# Altium project PA_v2.PrjPcb
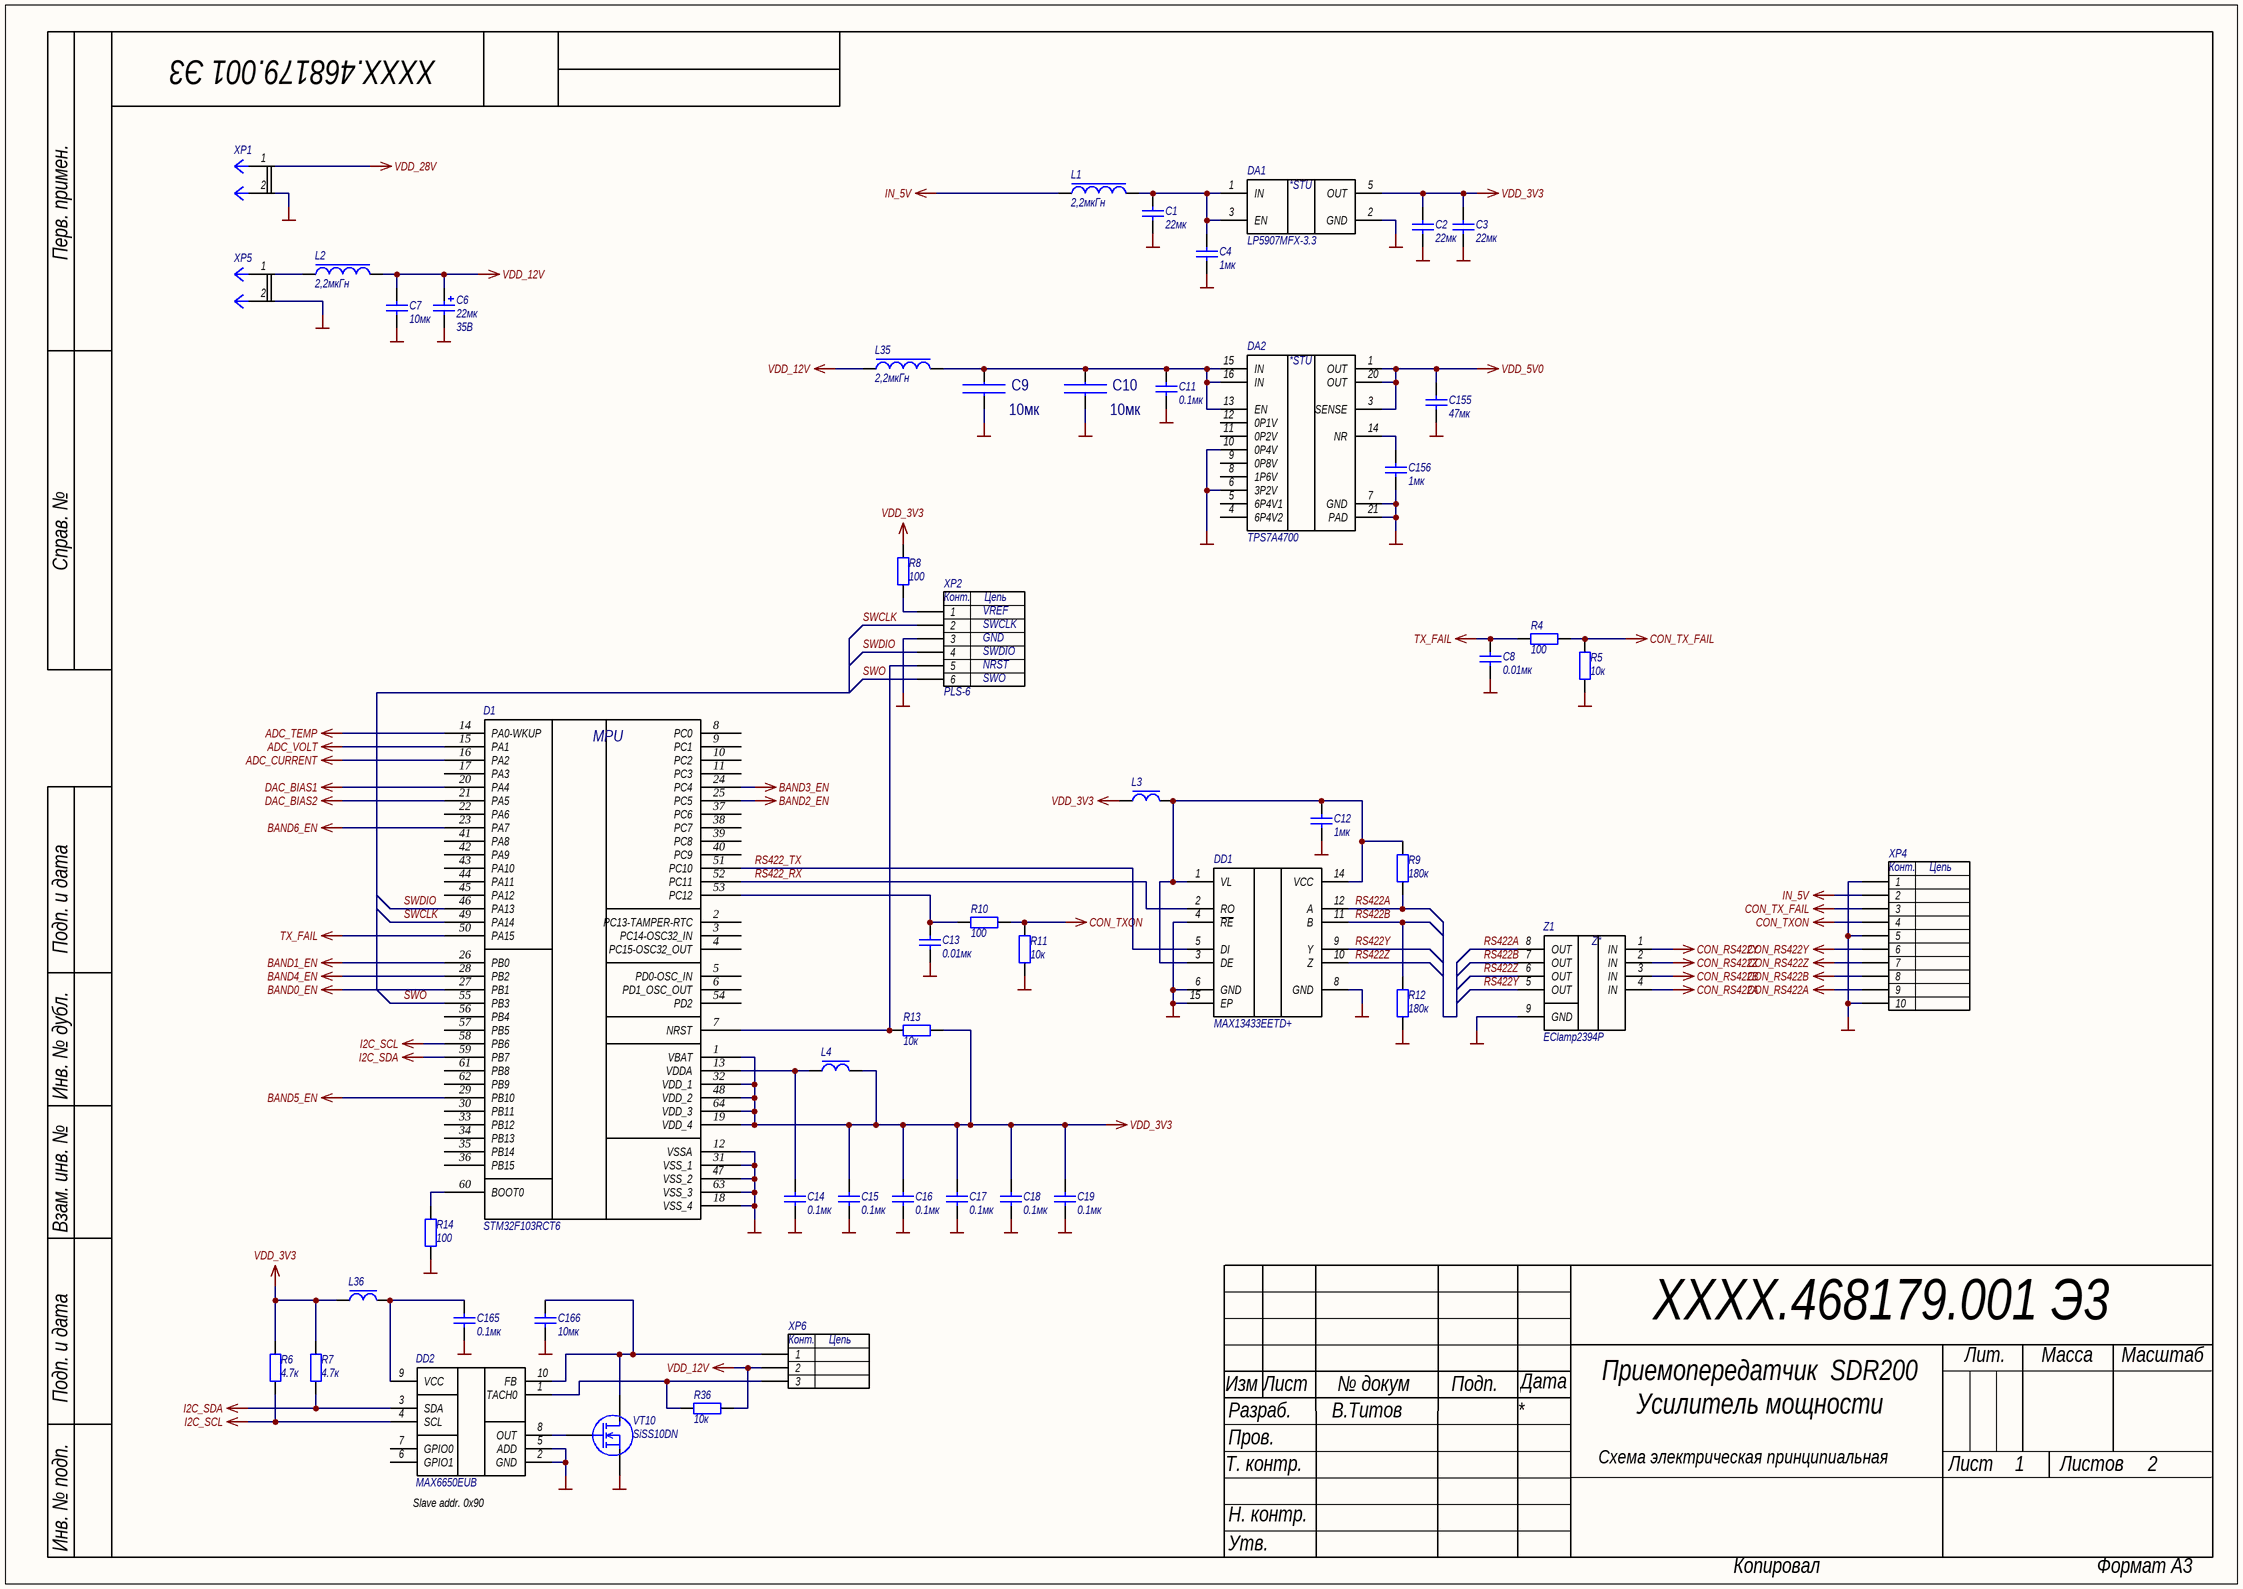
[diagram p0: PA_MCU.SchDoc]
2 sheets, 152 parts. Net scope: global (net labels, ports and power ports of the same name join across sheets).
Board file: PA_v2.PcbDoc
Sheets:
  PA_MCU.SchDoc
  PA_AMP.SchDoc

## Sheet PA_MCU.SchDoc: Приемопередатчик  SDR200
size 420 x 297 mm; Author: В.Титов; DrawnBy: В.Титов; DocumentNumber: ХХХХ.468179.001 Э3; SheetNumber: 1; SheetTotal: 2; DocumentType: Схема электрическая принципиальная; Title2: Усилитель мощности; Scale: 1:1

### Parts
C1  22мк  [CAPC2012X12L]
C2  22мк  [CAPC2012X12L]
C3  22мк  [CAPC2012X12L]
C4  1мк  [CAPC1005X06N]
C6  Power/Voltage: 35В  [CAPMP7343X28L]  (hidden comment: 22мк)
C7  10мк  [CAPC3225X27L]
C8  0.01мк  [CAPC1005X06N]
C9  Nominal: 10мк  [CAPC2012X09L]  (hidden comment: CC0805KKX5R8BB106)
C10  Nominal: 10мк  [CAPC2012X09L]  (hidden comment: CC0805KKX5R8BB106)
C11  0.1мк  [CAPC1005X06N]
C12  1мк  [CAPC1005X06N]
C13  0.01мк  [CAPC1005X06N]
C14  0.1мк  [CAPC1005X06N]
C15  0.1мк  [CAPC1005X06N]
C16  0.1мк  [CAPC1005X06N]
C17  0.1мк  [CAPC1005X06N]
C18  0.1мк  [CAPC1005X06N]
C19  0.1мк  [CAPC1005X06N]
C155  47мк  [CAPC2012X12L]
C156  1мк  [CAPC1005X06N]
C165  0.1мк  [CAPC1005X06N]
C166  10мк  [CAPC3225X27L]
D1  STM32F103RCT6  [QFP50P1200X1200X160-64N]
DA1  LP5907MFX-3.3  [SOT23-5AM]
DA2  TPS7A4700  [QFN65P500X500X100_HS-21L]
DD1  MAX13433EETD+  [SON40P300X80_HS-15L]
DD2  MAX6650EUB  [TSSOP50P490X110-10N]
L1  2,2мкГн  [CSAB0420]
L2  2,2мкГн  [CSAB0420]
L3  BLM18PG121SN1D  [INDC1608X08L]  (value not drawn)
L4  BLM18PG121SN1D  [INDC1608X08L]  (value not drawn)
L35  2,2мкГн  [CSAB0420]
L36  BLM18PG121SN1D  [INDC1608X08L]  (value not drawn)
R4  100  [RESC1005X06N]
R5  10к  [RESC1005X06N]
R6  4.7к  [RESC1005X06N]
R7  4.7к  [RESC1005X06N]
R8  100  [RESC1005X06N]
R9  180к  [RESC1005X06N]
R10  100  [RESC1005X06N]
R11  10к  [RESC1005X06N]
R12  180к  [RESC1005X06N]
R13  10к  [RESC1005X06N]
R14  100  [RESC1005X06N]
R36  10к  [RESC1005X06N]
VT10  SiSS10DN  [PowerPAK_1212-8W]
XP1  XT60-F  [XT60-F]  (value not drawn)
XP2  PLS-6  [HDR1X6]
XP4  FH12-10S-0.5SVA  [FH12-10S-0.5SH]  (value not drawn)
XP5  XT30UPB-M  [XT30UPB-M]  (value not drawn)
XP6  22232031  [22232031]  (value not drawn)
Z1  EClamp2394P  [SON50P160X65_HS-9N]

### Nets
ADC_CURRENT: D1.16(PA2)
ADC_TEMP: D1.14(PA0-WKUP)
ADC_VOLT: D1.15(PA1)
BAND0_EN: D1.27(PB1)
BAND1_EN: D1.26(PB0)
BAND2_EN: D1.25(PC5)
BAND3_EN: D1.24(PC4)
BAND4_EN: D1.28(PB2)
BAND5_EN: D1.29(PB10)
BAND6_EN: D1.23(PA7)
CON_RS422A: XP4.9 Z1.4(IN)
CON_RS422B: XP4.8 Z1.3(IN)
CON_RS422Y: XP4.6 Z1.1(IN)
CON_RS422Z: XP4.7 Z1.2(IN)
CON_TX_FAIL: R4.1 R5.1 XP4.3
CON_TXON: R10.1 R11.1 XP4.4
DAC_BIAS1: D1.20(PA4)
DAC_BIAS2: D1.21(PA5)
GND: C1.1 C2.1 C3.1 C4.1 C6.1 C7.1 C8.1 C11.1 C12.1 C13.1 C14.1 C15.1 C16.1 C17.1 C18.1 C19.1 C155.1 C156.1 C165.1 C166.1 D1.12(VSSA) D1.18(VSS_4) D1.31(VSS_1) D1.47(VSS_2) D1.63(VSS_3) DA1.2(GND) DA2.6(3P2V) DA2.7(GND) DA2.10(0P4V) DA2.21(PAD) DD1.4(~{RE}) DD1.6(GND) DD1.8(GND) DD1.15(EP) DD2.2(GND) DD2.5(ADD) R5.2 R11.2 R12.1 R14.2 VT10.S XP1.2 XP2.3 XP4.1 XP4.5 XP4.10 XP5.2 Z1.9(GND)
I2C_SCL: D1.58(PB6) DD2.4(SCL) R6.1
I2C_SDA: D1.59(PB7) DD2.3(SDA) R7.1
IN_5V: L1.1 XP4.2
TX_FAIL: C8.2 D1.50(PA15) R4.2
VDD_3V3: C2.2 C3.2 C15.2 C16.2 C17.2 C18.2 C19.2 D1.1(VBAT) D1.19(VDD_4) D1.32(VDD_1) D1.48(VDD_2) D1.64(VDD_3) DA1.5(OUT) L3.1 L4.2 L36.1 R6.2 R7.2 R8.1 R13.2
VDD_5V0: C155.2 DA2.1(OUT) DA2.3(SENSE) DA2.20(OUT)
VDD_12V: C6.2 C7.2 L2.2 L35.1 R36.2 XP6.2
VDD_28V: XP1.1
RS422_RX: D1.52(PC11) DD1.2(RO)
RS422_TX: D1.51(PC10) DD1.5(DI)
RS422A: DD1.12(A) R9.1 Z1.8(OUT)
RS422B: DD1.11(B) R12.2 Z1.7(OUT)
RS422Y: DD1.9(Y) Z1.5(OUT)
RS422Z: DD1.10(Z) Z1.6(OUT)
SWCLK: D1.49(PA14) XP2.2
SWDIO: D1.46(PA13) XP2.4
SWO: D1.55(PB3) XP2.6
NetC1_2: C1.2 C4.2 DA1.1(IN) DA1.3(EN) L1.2
NetC9_2: C9.2 C10.2 C11.2 DA2.13(EN) DA2.15(IN) DA2.16(IN) L35.2
NetC12_2: C12.2 DD1.1(VL) DD1.3(DE) DD1.14(VCC) L3.2 R9.2
NetC13_2: C13.2 D1.53(PC12) R10.2
NetC14_2: C14.2 D1.13(VDDA) L4.1
NetC156_2: C156.2 DA2.14(NR)
NetC165_2: C165.2 DD2.9(VCC) L36.2
NetC166_2: C166.2 DD2.10(FB) VT10.D XP6.1
NetD1_7: D1.7(NRST) R13.1 XP2.5
NetD1_60: D1.60(BOOT0) R14.1
NetDD2_1: DD2.1(TACH0) R36.1 XP6.3
NetDD2_8: DD2.8(OUT) VT10.G
NetL2_1: L2.1 XP5.1
NetR8_2: R8.2 XP2.1

Not connected (* = marked no-connect by the designer): C9 1; C10 1; D1 2(PC13-TAMPER-RTC) 3(PC14-OSC32_IN) 4(PC15-OSC32_OUT) 5(PD0-OSC_IN) 6(PD1_OSC_OUT) 8(PC0) 9(PC1) 10(PC2) 11(PC3) 17(PA3) 22(PA6) 30(PB11) 33(PB12) 34(PB13) 35(PB14) 36(PB15) 37(PC6) 38(PC7) 39(PC8) 40(PC9) 41(PA8) 42(PA9) 43(PA10) 44(PA11) 45(PA12) 54(PD2) 56(PB4) 57(PB5) 61(PB8) 62(PB9); DA2 4(6P4V2) 5(6P4V1) 8(1P6V) 9(0P8V) 11(0P2V) 12(0P1V); DD2 6(GPIO1) 7(GPIO0)

### Notes on the sheet
- (near XP2) VREF
- (near XP2) SWCLK
- (near XP2) GND
- (near XP2) SWDIO
- (near XP2) NRST
- (near XP2) SWO
- (near DD2) Slave addr. 0x90
- Перв. примен.
- Справ. №
- Подп. и дата
- Инв. № дубл.
- Взам. инв. №
- Изм
- Лист
- № докум
- Подп.
- Дата
- Лит.
- Масса
- Масштаб
- Т. контр.
- Разраб.
- Пров.
- Листов
- Н. контр.
- Инв. № подп.
- Утв.
- Копировал
- Формат А3
- (in symbol Микросхема LP5907MFX-3.3) *STU
- (in symbol Микросхема STM32F103RCT6) MPU
- (in symbol Микросхема TPS7A4700RGW) *STU
- (in symbol Соединитель 22232031) Конт.; Цепь
- (in symbol Соединитель FH12-10S-0.5SVA) Конт.; Цепь
- (in symbol Соединитель PLS-6) Конт.; Цепь
- (in symbol Фильтр EMI EClamp2394P) Z*

### Library data of the parts
C1-C3 = Кер.ЧИП конд. 0805 22мкФ X5R 10% 16В: Кер. ЧИП-конденсатор; Manufacturer: TDK; ManufacturerPartNumber: C2012X5R1C226KT; Power/Voltage: 16В; TKE: X5R; Tolerance: ±10%; Value: 22мк
C4 C12 C156 = Кер.ЧИП конд. 0402 1мкФ X5R 10%, 10В: Кер. ЧИП-конденсатор; Power/Voltage: 10В; TKE: X5R; Tolerance: ±10%; PackageReference: 0402; Value: 1мк
C6 = Конденсатор танталовый SMD D case 22мкФ ±20% 35B: Тант. ЧИП-конденсатор; Tolerance: ±20%; Published: 8-Jun-2000; LatestRevisionDate: 29-May-2009; LatestRevisionNote: IPC-7351 Footprint Added.; Publisher: Altium Limited; PackageDescription: Chip Capacitor; PackageReference: тип D; Value: 22мк
C7 C166 = Кер.ЧИП конд. 1210 10мкФ X5R 20% 50В: Кер. ЧИП-конденсатор; Manufacturer: Murata; ManufacturerPartNumber: GRM32ER71H106; Power/Voltage: 50В; TKE: X5R; Tolerance: ±20%; Value: 10мк
C8 C13 = Кер.ЧИП конд. 0402 0.01мкФ X7R 10%, 50В: Кер. ЧИП-конденсатор; Power/Voltage: 50В; TKE: X7R; Tolerance: ±20%; Value: 0.01мк
C9 C10 = CC0805KKX5R8BB106: ЧИП конденсатор; Manufacturer: Yageo; Tolerance: 0,1; Value: 0805 10 мкФ 25В X7R; Type: X7R; RuNominal: 10 мкФ; Voltage: 25В; ManufacturerPartNumber: CC0805KKX5R8BB106; ID: 0805 10 мкФ 25В X7R; Rem: *
C11 C14-C19 C165 = Кер.ЧИП конд. 0402 0.1мкФ X7R 10%, 16В: Кер. ЧИП-конденсатор; Power/Voltage: 16В; TKE: X7R; Tolerance: ±10%; PackageReference: 0402; Value: 0.1мк
C155 = Кер.ЧИП конд. 0805 47мкФ X5R 20% 10В: Кер. ЧИП-конденсатор; Manufacturer: Murata; ManufacturerPartNumber: GRM21BR61A476ME15L; Power/Voltage: 10В; TKE: X5R; Tolerance: ±20%; Value: 47мк
D1 = Микросхема STM32F103RCT6: Ultra-low-power 32-bit MCU ARM®-based Cortex®-M3, 128KB Flash, 16KB SRAM, 4KB EEPROM, LCD, USB, ADC, DAC; Manufacturer: STMicroelectronics; Published: 29-Jan-2009; Code_JEDEC: MS-026; ComponentLink1Description: Manufacturer Link; ComponentLink3Description: Packaging Specification; Value: STM32F103RCT6
DA1 = Микросхема LP5907MFX-3.3: 250-mA Ultra-Low-Noise, Low-IQ LDO; Manufacturer: TI; Value: LP5907MFX-3.3; ComponentLink1Description: datasheet; ComponentLink1URL: http://www.ti.com/lit/ds/symlink/lp5907.pdf
DA2 = Микросхема TPS7A4700RGW: 36-V, 1-A, 4-µVRMS, RF LDO Voltage Regulator; Manufacturer: TI; Value: TPS7A4700; ComponentLink1Description: datasheet; ComponentLink1URL: http://www.ti.com/lit/ds/symlink/tps7a47.pdf
DD1 = Микросхема MAX13433EETD+: RS-422 Transceivers with Low-Voltage Logic Interface 16M; Manufacturer: Maxim; Value: MAX13433EETD+; ComponentLink1Description: datasheet; ComponentLink1URL: https://datasheets.maximintegrated.com/en/ds/MAX13430E-MAX13433E.pdf
DD2 = Микросхема MAX6650EUB: Fan-Speed Regulators and Monitors with SMBus/I2C-Compatible Interface; Manufacturer: Maxim; Value: MAX6650EUB; ComponentLink1Description: datasheet; ComponentLink1URL: https://www.analog.com/media/en/technical-documentation/data-sheets/MAX6650-MAX6651.pdf
L1 L2 L35 = ЧИП индуктивность CSAB0420-2R2M: Molding Power Choke; Manufacturer: Vishay; ManufacturerPartNumber: IHLP1616ABER1R0M11; Value: 2,2мкГн
L3 L4 L36 = ЧИП дроссель 0603 BLM18PG121SN1D: SMD EMI Suppression Filter EMIFIL; Manufacturer: Murata; ManufacturerPartNumber: BLM18PG121SN1D; Value: BLM18PG121SN1D
R4 R8 R10 R14 = Чип резистор 0402 100 Ом, 5%: ЧИП-резистор; Tolerance: ±5%; TKE: 100 ppm/°С; PackageReference: 0402; Value: 100
R5 R11 R13 R36 = Чип резистор 0402 10 кОм, 5%: ЧИП-резистор; Tolerance: ±5%; TKE: 100 ppm/°С; PackageReference: 0402; Value: 10к
R6 R7 = Чип резистор 0402 4,7 кОм, 5%: ЧИП-резистор; Tolerance: ±5%; TKE: 100 ppm/°С; PackageReference: 0402; Value: 4.7к
R9 R12 = Чип резистор 0402 180 кОм, 5%: ЧИП-резистор; Tolerance: ±5%; TKE: 100 ppm/°С; PackageReference: 0402; Value: 180к
VT10 = ЧИП транзистор SiSS10DN: N-Channel 40 V (D-S) MOSFET; ComponentLink1Description: datasheet; ComponentLink1URL: https://www.vishay.com/docs/65439/siss10dn.pdf; Value: SiSS10DN
XP1 = Соединитель XT60-F: AMASS XT60-F; Value: XT60-F
XP2 = Соединитель PLS-6: Вилка штыревая 2.54мм 1x6 прямая тип1; LatestRevisionDate: 17-Jul-2002; LatestRevisionNote: Re-released for DXP Platform.; Publisher: Altium Limited; Value: PLS-6
XP4 = Соединитель FH12-10S-0.5SVA: 0.5mm  Pitch FPC/FFC Connector FH12 Series; Manufacturer: Hirose; Value: FH12-10S-0.5SVA
XP5 = Соединитель XT30UPB-M: AMASS XT30UPB-M  5 mm; Value: XT30UPB-M
XP6 = Соединитель 22232031: Molex 2,54 мм pitch-3; Manufacturer: Connfly; Value: 22232031
Z1 = Фильтр EMI EClamp2394P: ESD/EMI Protection  for Color LCD Interfaces; Manufacturer: SEMTECH; PackageReference: SLP2116P8; Value: EClamp2394P

## Sheet PA_AMP.SchDoc: Приемопередатчик  SDR200
size 420 x 297 mm; Author: В.Титов; DrawnBy: В.Титов; DocumentNumber: ХХХХ.468179.001 Э3; SheetNumber: 2; SheetTotal: 2; DocumentType: Схема электрическая принципиальная; Title2: Усилитель мощности; Scale: 1:1
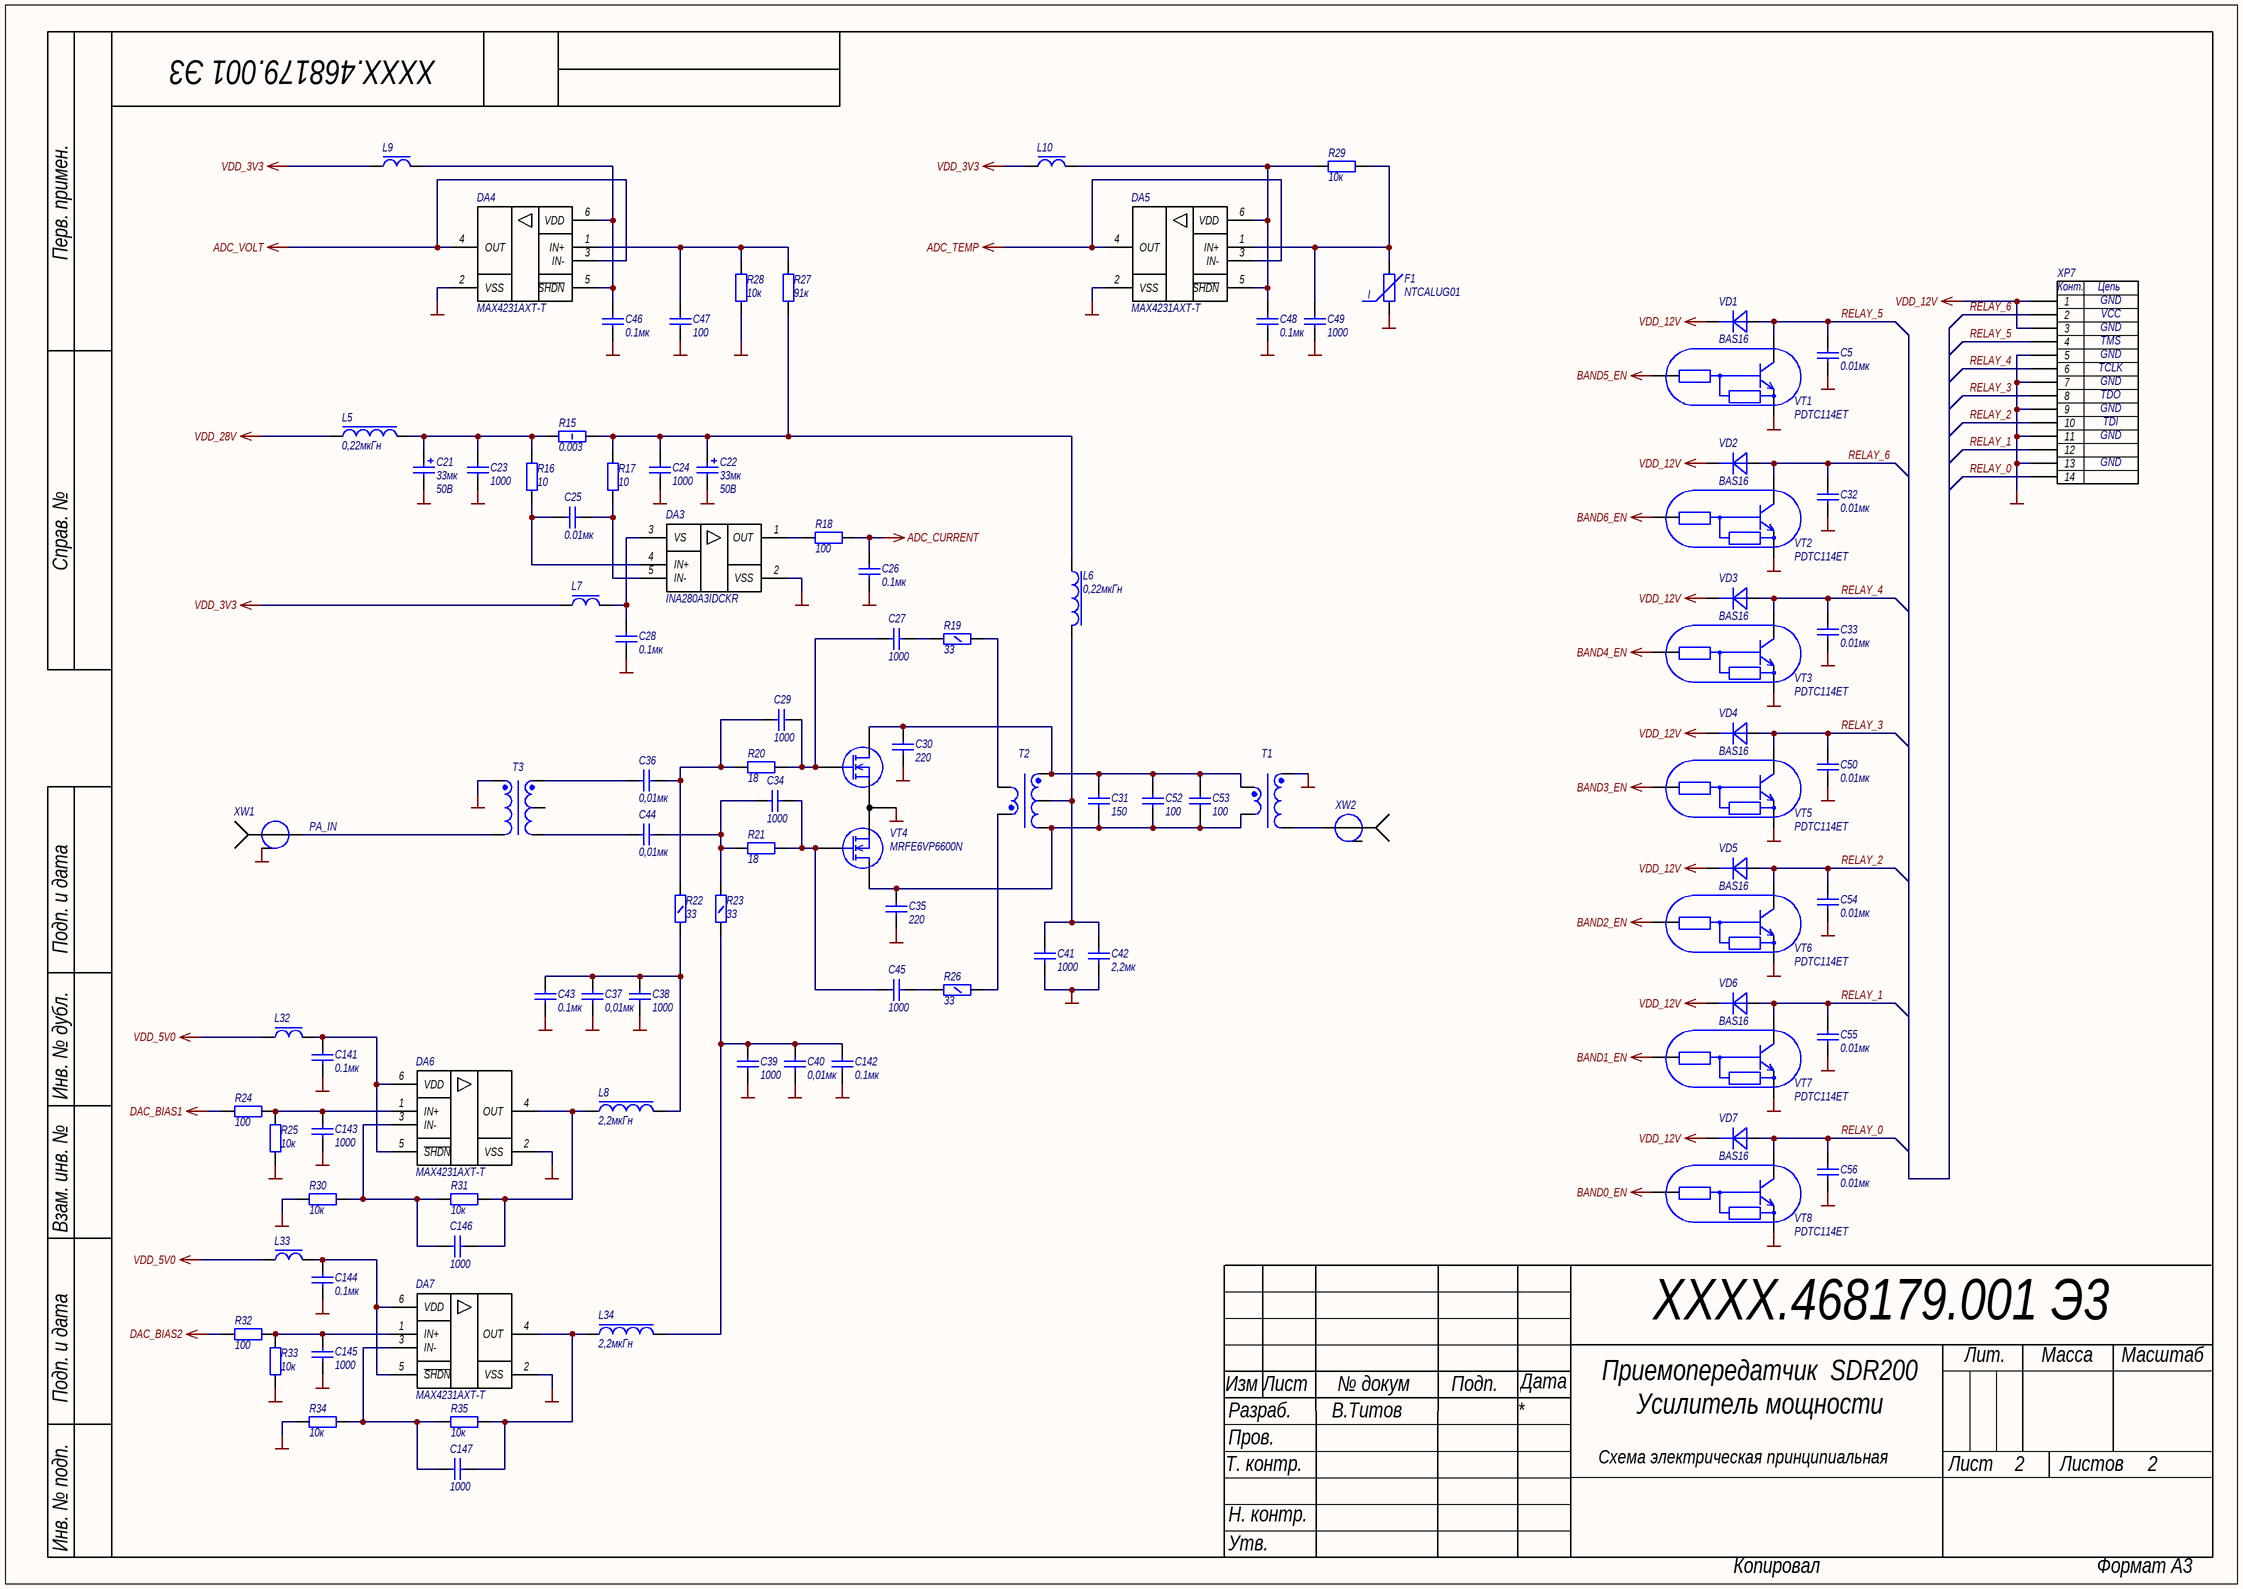
[diagram p1: PA_AMP.SchDoc]

### Parts
C5  0.01мк  [CAPC1005X06N]
C21  Power/Voltage: 50В  [CAPAE7664X77L]  (hidden comment: 33мк)
C22  Power/Voltage: 50В  [CAPAE7664X77L]  (hidden comment: 33мк)
C23  1000  [CAPC2012X12L]
C24  1000  [CAPC2012X12L]
C25  0.01мк  [CAPC1005X06N]
C26  0.1мк  [CAPC1005X06N]
C27  1000  [CAPC3216X19L]
C28  0.1мк  [CAPC1005X06N]
C29  1000  [CAPC2012X12L]
C30  220  [CAPC3216X19L]
C31  150  [CAPC3216X19L]
C32  0.01мк  [CAPC1005X06N]
C33  0.01мк  [CAPC1005X06N]
C34  1000  [CAPC2012X12L]
C35  220  [CAPC3216X19L]
C36  0,01мк  [CAPC2012X12L]
C37  0,01мк  [CAPC2012X12L]
C38  1000  [CAPC2012X12L]
C39  1000  [CAPC2012X12L]
C40  0,01мк  [CAPC2012X12L]
C41  1000  [CAPC3216X19L]
C42  2,2мк  [CAPC3216X19L]
C43  0.1мк  [CAPC1608X08L]
C44  0,01мк  [CAPC2012X12L]
C45  1000  [CAPC3216X19L]
C46  0.1мк  [CAPC1005X06N]
C47  100  [CAPC1005X06N]
C48  0.1мк  [CAPC1005X06N]
C49  1000  [CAPC1005X06N]
C50  0.01мк  [CAPC1005X06N]
C52  100  [CAPC3216X19L]
C53  100  [CAPC3216X19L]
C54  0.01мк  [CAPC1005X06N]
C55  0.01мк  [CAPC1005X06N]
C56  0.01мк  [CAPC1005X06N]
C141  0.1мк  [CAPC1005X06N]
C142  0.1мк  [CAPC1608X08L]
C143  1000  [CAPC1005X06N]
C144  0.1мк  [CAPC1005X06N]
C145  1000  [CAPC1005X06N]
C146  1000  [CAPC1005X06N]
C147  1000  [CAPC1005X06N]
DA3  INA280A3IDCKR  [SOT65P210X110-5L]
DA4  MAX4231AXT-T  [TSOP65P210X100-6L]
DA5  MAX4231AXT-T  [TSOP65P210X100-6L]
DA6  MAX4231AXT-T  [TSOP65P210X100-6L]
DA7  MAX4231AXT-T  [TSOP65P210X100-6L]
F1  NTCALUG01  [NTCALUG01T]
L5  0,22мкГн  [CSAB0530]
L6  0,22мкГн  [CSAB0530]
L7  BLM18PG121SN1D  [INDC1608X08L]  (value not drawn)
L8  2,2мкГн  [CSAB0420]
L9  BLM18PG121SN1D  [INDC1608X08L]  (value not drawn)
L10  BLM18PG121SN1D  [INDC1608X08L]  (value not drawn)
L32  BLM18PG121SN1D  [INDC1608X08L]  (value not drawn)
L33  BLM18PG121SN1D  [INDC1608X08L]  (value not drawn)
L34  2,2мкГн  [CSAB0420]
R15  0.003  [RESC6332X04N]
R16  10  [RESC1005X06N]
R17  10  [RESC1005X06N]
R18  100  [RESC1005X06N]
R19  33  [RESC3216X04L]
R20  18  [RESC2012X05L]
R21  18  [RESC2012X05L]
R22  33  [RESC3216X04L]
R23  33  [RESC3216X04L]
R24  100  [RESC1005X06N]
R25  10к  [RESC1005X06N]
R26  33  [RESC3216X04L]
R27  91к  [RESC1005X06N]
R28  10к  [RESC1005X06N]
R29  10к  [RESC1005X06N]
R30  10к  [RESC1005X06N]
R31  10к  [RESC1005X06N]
R32  100  [RESC1005X06N]
R33  10к  [RESC1005X06N]
R34  10к  [RESC1005X06N]
R35  10к  [RESC1005X06N]
T1  Трансформатор PUM_IN  [TRANSFORMER_KV_PAOUT_400W]  (value not drawn)
T2  Трансформатор PUM_IN  [TRSF_VOLT]  (value not drawn)
T3  Трансформатор PUM_IN  [Transformer_KV_PAIN]  (value not drawn)
VD1  BAS16  [SOT23_N]
VD2  BAS16  [SOT23_N]
VD3  BAS16  [SOT23_N]
VD4  BAS16  [SOT23_N]
VD5  BAS16  [SOT23_N]
VD6  BAS16  [SOT23_N]
VD7  BAS16  [SOT23_N]
VT1  PDTC114ET  [SOT23_N]
VT2  PDTC114ET  [SOT23_N]
VT3  PDTC114ET  [SOT23_N]
VT4  MRFE6VP6600N  [OM-780-4L]
VT5  PDTC114ET  [SOT23_N]
VT6  PDTC114ET  [SOT23_N]
VT7  PDTC114ET  [SOT23_N]
VT8  PDTC114ET  [SOT23_N]
XP7  IDC2-14MS  [IDC2-14MS]  (value not drawn)
XW1  SMA-JR  [SMA-JR]  (value not drawn)
XW2  SMA-JR  [SMA-JR]  (value not drawn)

### Nets
ADC_CURRENT: C26.2 R18.1
ADC_TEMP: DA5.3(IN-) DA5.4(OUT)
ADC_VOLT: DA4.3(IN-) DA4.4(OUT)
BAND0_EN: VT8.1(B)
BAND1_EN: VT7.1(B)
BAND2_EN: VT6.1(B)
BAND3_EN: VT5.1(B)
BAND4_EN: VT3.1(B)
BAND5_EN: VT1.1(B)
BAND6_EN: VT2.1(B)
DAC_BIAS1: R24.1
DAC_BIAS2: R32.1
GND: C5.1 C21.2 C22.2 C23.1 C24.1 C26.1 C28.1 C30.1 C32.1 C33.1 C35.1 C37.1 C38.1 C39.1 C40.1 C41.1 C42.1 C43.1 C46.2 C47.2 C48.2 C49.2 C50.1 C54.1 C55.1 C56.1 C141.1 C142.1 C143.1 C144.1 C145.1 DA3.2(VSS) DA4.2(VSS) DA5.2(VSS) DA6.2(VSS) DA7.2(VSS) F1.2 R25.2 R28.1 R30.1 R33.2 R34.1 T1.3 T3.5(PRIMARY_DOT) VT1.2(E) VT2.2(E) VT3.2(E) VT4.5(S) VT5.2(E) VT6.2(E) VT7.2(E) VT8.2(E) XP7.5 XP7.7 XP7.9 XP7.11 XP7.13 XW1.2
VDD_3V3: L7.1 L9.1 L10.1
VDD_5V0: L32.1 L33.1
VDD_12V: VD1.3(K) VD2.3(K) VD3.3(K) VD4.3(K) VD5.3(K) VD6.3(K) VD7.3(K) XP7.1 XP7.3
VDD_28V: L5.1
RELAY_0: C56.2 VD7.1(A) VT8.3(C) XP7.14
RELAY_1: C55.2 VD6.1(A) VT7.3(C) XP7.12
RELAY_2: C54.2 VD5.1(A) VT6.3(C) XP7.10
RELAY_3: C50.2 VD4.1(A) VT5.3(C) XP7.8
RELAY_4: C33.2 VD3.1(A) VT3.3(C) XP7.6
RELAY_5: C5.2 VD1.1(A) VT1.3(C) XP7.4
RELAY_6: C32.2 VD2.1(A) VT2.3(C) XP7.2
NetC21_1: C21.1 C23.2 L5.2 R15.1 R16.1
NetC22_1: C22.1 C24.2 L6.1 R15.2 R17.1 R27.2
NetC25_1: C25.1 DA3.5(GND) R17.2
NetC25_2: C25.2 DA3.4(IN+) R16.2
NetC27_1: C27.1 R19.1
NetC27_2: C27.2 C29.1 R20.2 VT4.3(GATE)
NetC28_2: C28.2 DA3.3(VS) L7.2
NetC29_2: C29.2 C36.1 R20.1 R22.1
NetC30_2: C30.2 C31.2 C52.2 C53.2 T1.1 T2.1 VT4.1(D)
NetC31_1: C31.1 C35.2 C52.1 C53.1 T1.2 T2.3 VT4.2(D)
NetC34_1: C34.1 C45.2 R21.2 VT4.4(GATE)
NetC34_2: C34.2 C44.1 R21.1 R23.1
NetC36_2: C36.2 T3.1(SECONDARY_DOT)
NetC37_2: C37.2 C38.2 C43.2 L8.2 R22.2
NetC39_2: C39.2 C40.2 C142.2 L34.2 R23.2
NetC41_2: C41.2 C42.2 L6.2 T2.2
NetC44_2: C44.2 T3.3(SECONDARY)
NetC45_1: C45.1 R26.1
NetC46_1: C46.1 DA4.5(GND) DA4.6(VDD) L9.2
NetC47_1: C47.1 DA4.1(IN+) R27.1 R28.2
NetC48_1: C48.1 DA5.5(GND) DA5.6(VDD) L10.2 R29.1
NetC49_1: C49.1 DA5.1(IN+) F1.1 R29.2
NetC141_2: C141.2 DA6.5(GND) DA6.6(VDD) L32.2
NetC143_2: C143.2 DA6.1(IN+) R24.2 R25.1
NetC144_2: C144.2 DA7.5(GND) DA7.6(VDD) L33.2
NetC145_2: C145.2 DA7.1(IN+) R32.2 R33.1
NetC146_1: C146.1 DA6.4(OUT) L8.1 R31.2
NetC146_2: C146.2 DA6.3(IN-) R30.2 R31.1
NetC147_1: C147.1 DA7.4(OUT) L34.1 R35.2
NetC147_2: C147.2 DA7.3(IN-) R34.2 R35.1
NetDA3_1: DA3.1(OUT) R18.2
NetR19_2: R19.2 T2.4(FB)
NetR26_2: R26.2 T2.5(FB)
NetT1_4: T1.4 XW2.1
NetT3_4: T3.4(PRIMARY) XW1.1

Not connected (* = marked no-connect by the designer): T3 2(SECONARY_CT); XW2 2

### Notes on the sheet
- (near XW1) PA_IN
- Перв. примен.
- Справ. №
- Подп. и дата
- Инв. № дубл.
- Взам. инв. №
- Изм
- Лист
- № докум
- Подп.
- Дата
- Лит.
- Масса
- Масштаб
- Т. контр.
- Разраб.
- Пров.
- Листов
- Н. контр.
- Инв. № подп.
- Утв.
- Копировал
- Формат А3
- (in symbol Соединитель IDC2-14MS) Конт.; Цепь; GND; VCC; TMS; TCLK; TDO; TDI
- (in symbol Терморезистор NTCALUG01) I

### Library data of the parts
C5 C25 C32 C33 C50 C54-C56 = Кер.ЧИП конд. 0402 0.01мкФ X7R 10%, 50В: as C8 on sheet PA_MCU; Value: 0.01мк
C21 C22 = Конденсатор гибридный SMD 33мкФ ±20% 50В: Гибридный ЧИП-конденсатор; ManufacturerPartNumber: EEHZC1H330XP; Manufacturer: Panasonic; Tolerance: ±20%; Published: 8-Jun-2000; LatestRevisionDate: 29-May-2009; LatestRevisionNote: IPC-7351 Footprint Added.; Publisher: Altium Limited; PackageDescription: ZC Series - Anti-Vibration; PackageReference: ZC Series; Value: 33мк
C23 C24 C29 C34 C38 C39 = Кер.ЧИП конд. 0805 1000пФ X7R 10% 100В: Кер. ЧИП-конденсатор; Manufacturer: WALSIN; ManufacturerPartNumber: 0805B102K100; Power/Voltage: 100В; TKE: X7R; Tolerance: ±10%; Value: 1000
C26 C28 C46 C48 C141 C144 = Кер.ЧИП конд. 0402 0.1мкФ X7R 10%, 16В: as C11 on sheet PA_MCU; PackageReference: 0402; Value: 0.1мк
C27 C41 C45 = Кер.ЧИП конд. 1206 1000пФ X7К 10% 2000В: Кер. ЧИП-конденсатор; Manufacturer: Johanson; ManufacturerPartNumber: 202R18W102KV4E; Power/Voltage: 2000В; TKE: X7R; Tolerance: ±10%; Value: 1000
C30 C35 C52 C53 = Кер.ЧИП конд. 1206 220пФ NP0 5% 2000В: Кер. ЧИП-конденсатор; Manufacturer: Johanson; ManufacturerPartNumber: 202R18W102KV4E; Power/Voltage: 2000В; TKE: X7R; Tolerance: ±10%
  C30 C35: Value: 220
  C52 C53: Value: 100
C31 = Кер.ЧИП конд. 1206 150пФ NP0 5% 2000В: Кер. ЧИП-конденсатор; Manufacturer: Johanson; ManufacturerPartNumber: 202R18W102KV4E; Power/Voltage: 2000В; TKE: X7R; Tolerance: ±10%; Value: 150
C36 C37 C40 C44 = Кер.ЧИП конд. 0805 0,01 мкФ X7R 10% 250В: Кер. ЧИП-конденсатор; Manufacturer: Murate; ManufacturerPartNumber: GRM21BR72E103KW03; Power/Voltage: 250В; TKE: X7R; Tolerance: ±10%; Value: 0,01мк
C42 = Кер.ЧИП конд. 1206 2,2мкФ X7R 10% 100В: Кер. ЧИП-конденсатор; Manufacturer: Murata; ManufacturerPartNumber: GRM31CR72A225KA73L; Power/Voltage: 100В; TKE: X7R; Tolerance: ±10%; Value: 2,2мк
C43 C142 = Кер.ЧИП конд. 0603 0.1мкФ X7R 10% 50В: Кер. ЧИП-конденсатор; Manufacturer: Murata; ManufacturerPartNumber: GRM188R71H104KA93D; Power/Voltage: 50В; TKE: X7R; Tolerance: ±10%; Value: 0.1мк
C47 = Кер.ЧИП конд. 0402 100пФ NPO 5%, 50В: Кер. ЧИП-конденсатор; Power/Voltage: 50В; TKE: NPO; Tolerance: ±5%; PackageReference: 0402; Value: 100
C49 C143 C145-C147 = Кер.ЧИП конд. 0402 1000пФ NP0 5%, 50В: Кер. ЧИП-конденсатор; Power/Voltage: 50В; TKE: NPO; Tolerance: ±5%; PackageReference: 0402; Value: 1000
DA3 = Микросхема INA280A3IDCKR: 2.7-V to 120-V, 1.1-MHz, High Precision Current Sense Amplifier in Small / (SC-70) Package; Manufacturer: TI; Value: INA280A3IDCKR; ComponentLink1Description: datasheet; ComponentLink1URL: https://datasheets.maximintegrated.com/en/ds/MAX4230-MAX4234.pdf
DA4-DA7 = Микросхема MAX4231AXT-T: High-Output-Drive, 10MHz, 10V/μs,  Rail-to-Rail I/O Op Amps with Shutdown in SC70; Manufacturer: MAXIM; Value: MAX4231AXT-T; ComponentLink1Description: datasheet; ComponentLink1URL: https://datasheets.maximintegrated.com/en/ds/MAX4230-MAX4234.pdf
F1 = Терморезистор NTCALUG01: ЧИП-резистор; Value: NTCALUG01
L5 L6 = ЧИП индуктивность CDCSAB0530-R22M: 0.22мкГн, 19А, 5.2х5.0х3мм, Катушка индуктивности SMD; Manufacturer: Vishay; ManufacturerPartNumber: CDCSAB0530-R22M; Value: 0,22мкГн
L7 L9 L10 L32 L33 = ЧИП дроссель 0603 BLM18PG121SN1D: as L3 on sheet PA_MCU; ManufacturerPartNumber: BLM18PG121SN1D; Value: BLM18PG121SN1D
L8 L34 = ЧИП индуктивность CSAB0420-2R2M: as L1 on sheet PA_MCU; Value: 2,2мкГн
R15 = Чип резистор 2512 0.003Ом, 5%: ЧИП-резистор PA2512FKF070R003E; Tolerance: ±5%; Value: 0.003
R16 R17 = Чип резистор 0402 10 Ом, 5%: ЧИП-резистор; Tolerance: ±5%; TKE: 100 ppm/°С; PackageReference: 0402; Value: 10
R18 R24 R32 = Чип резистор 0402 100 Ом, 5%: as R4 on sheet PA_MCU; PackageReference: 0402; Value: 100
R19 R22 R23 R26 = Чип резистор 1206 33 Ом, 5%: ЧИП-резистор; Manufacturer: ROHM; Tolerance: ±5%; TKE: 300 ppm/°С; PackageReference: 1206; Value: 33
R20 R21 = Чип резистор 0805 18 Ом, 5%: ЧИП-резистор; Tolerance: ±5%; TKE: 100 ppm/°С; PackageReference: 0805; Value: 18
R25 R28-R31 R33-R35 = Чип резистор 0402 10 кОм, 5%: as R5 on sheet PA_MCU; PackageReference: 0402; Value: 10к
R27 = Чип резистор 0402 91 кОм, 5%: ЧИП-резистор; Tolerance: ±5%; TKE: 100 ppm/°С; PackageReference: 0402; Value: 91к
T1 = Трансформатор PA_OUT
T2 = Трансформатор PA_OUT_VOLT
T3 = Transformer_KV_PA: Трансформатор на бинокле BN-43-302 (2843000302)mu850 / Первичная обмотка - 2 витка проводом МГТФ 0,12 / Вторичная обмотка - 2 витка проводом МГТФ 0,12; Manufacturer: НЕЛС; Manufacturer Part Number: Трансформатор PUM_IN АНЕЛ.671143.002; SubType: Трансформатор бинокле; Package: BN-43-302 (2843000302) 13.3x10.3 mm; Type: Трансформатор
VD1-VD7 = ЧИП диод BAS16: High-speed switching diodes; Manufacturer: Nexperia; Power/Voltage: 100В; ManufacturerPartNumber: BAS16; Value: BAS16; ComponentLink1Description: datasheet; ComponentLink1URL: https://assets.nexperia.com/documents/data-sheet/BAS16_SER.pdf
VT1-VT3 VT5-VT8 = ЧИП транзистор PDTC114ET: NPN resistor-equipped transistors;  R1 = 10 k, R2 = 10; ComponentLink1Description: datasheet; ComponentLink1URL: https://assets.nexperia.com/documents/data-sheet/PDTC114E_SER.pdf; Value: PDTC114ET
VT4 = Транзистор MRFE6VP6600N: RF Power LDMOS Transistors; ComponentLink1Description: datasheet; ComponentLink1URL: https://www.nxp.com/docs/en/data-sheet/MRFE6VP6600N.pdf; Value: MRFE6VP6600N
XP7 = Соединитель IDC2-14MS: JTAG Xilinx IDC2-14MS; Manufacturer: Molex; Value: IDC2-14MS
XW1 XW2 = Соединитель коаксиальный SMA-JR: SMA-JR Разъем SMA гнездо на плату, прямой угол; Value: SMA-JR; ComponentLink1Description: datasheet; ComponentLink1URL: http://www.brownbear.ru/goods/2243.html

## Nets that join several sheets
ADC_CURRENT: PA_MCU (D1.16), PA_AMP (C26.2 R18.1)
ADC_TEMP: PA_MCU (D1.14), PA_AMP (DA5.3 DA5.4)
ADC_VOLT: PA_MCU (D1.15), PA_AMP (DA4.3 DA4.4)
BAND0_EN: PA_MCU (D1.27), PA_AMP (VT8.1)
BAND1_EN: PA_MCU (D1.26), PA_AMP (VT7.1)
BAND2_EN: PA_MCU (D1.25), PA_AMP (VT6.1)
BAND3_EN: PA_MCU (D1.24), PA_AMP (VT5.1)
BAND4_EN: PA_MCU (D1.28), PA_AMP (VT3.1)
BAND5_EN: PA_MCU (D1.29), PA_AMP (VT1.1)
BAND6_EN: PA_MCU (D1.23), PA_AMP (VT2.1)
DAC_BIAS1: PA_MCU (D1.20), PA_AMP (R24.1)
DAC_BIAS2: PA_MCU (D1.21), PA_AMP (R32.1)
GND: PA_MCU (48 pins), PA_AMP (58 pins)
VDD_3V3: PA_MCU (20 pins), PA_AMP (L7.1 L9.1 L10.1)
VDD_5V0: PA_MCU (C155.2 DA2.1 DA2.3 DA2.20), PA_AMP (L32.1 L33.1)
VDD_12V: PA_MCU (6 pins), PA_AMP (9 pins)
VDD_28V: PA_MCU (XP1.1), PA_AMP (L5.1)